# Altium project golgi_bot_raspberry.PrjPcb
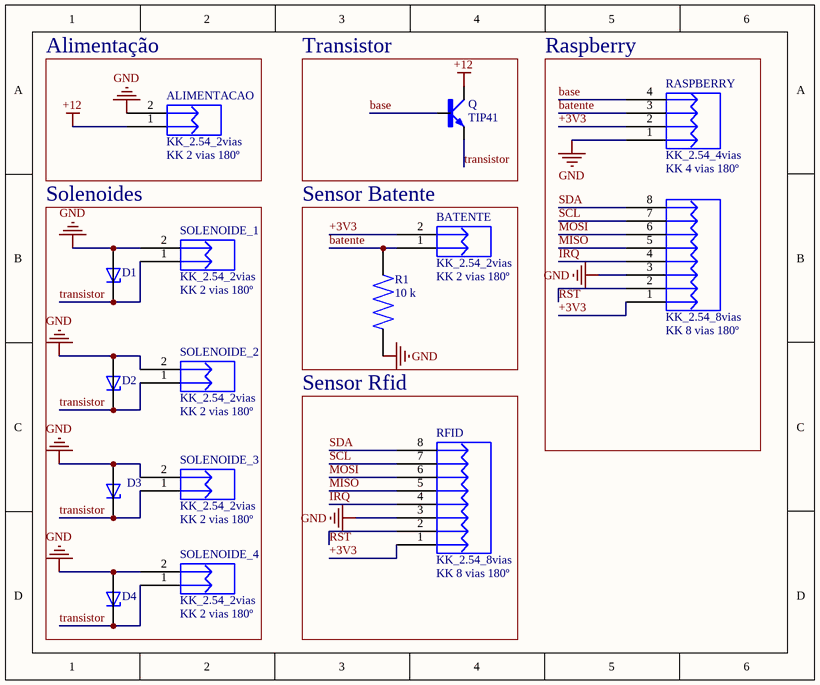
[diagram p0: golgi_bot_raspberry.SchDoc]
1 sheet, 15 parts. Net scope: global (net labels, ports and power ports of the same name join across sheets).
Board file: golgi_bot_raspberry.PcbDoc

## Sheet golgi_bot_raspberry.SchDoc
size 152 x 127 mm; SheetNumber: 1; SheetTotal: 1

### Parts
ALIMENTACAO  KK_2.54_2vias  Valor: KK 2 vias 180º  [KK_2VIAS_180º]
BATENTE  KK_2.54_2vias  Valor: KK 2 vias 180º  [KK_2VIAS_180º]
D1  (no value)  [SODFL3718X102N]
D2  (no value)  [SODFL3718X102N]
D3  (no value)  [SODFL3718X102N]
D4  (no value)  [SODFL3718X102N]
Q  TIP41  [TRANSISTOR-TO220AV-BCE]
R1  10 k  [RESC3115X65N]
RASPBERRY  KK_2.54_4vias  Valor: KK 4 vias 180º  [KK_4vias_180°]
RFID  KK_2.54_8vias  Valor: KK 8 vias 180º  [KK_8vias_180°]
SOLENOIDE_1  KK_2.54_2vias  Valor: KK 2 vias 180º  [KK_2VIAS_180º]
SOLENOIDE_2  KK_2.54_2vias  Valor: KK 2 vias 180º  [KK_2VIAS_180º]
SOLENOIDE_3  KK_2.54_2vias  Valor: KK 2 vias 180º  [KK_2VIAS_180º]
SOLENOIDE_4  KK_2.54_2vias  Valor: KK 2 vias 180º  [KK_2VIAS_180º]
  KK_2.54_8vias  Valor: KK 8 vias 180º  [KK_8vias_180°]

### Blocks framed on the sheet
Alimentação: ALIMENTACAO
Transistor: Q
Raspberry: RASPBERRY 
Solenoides: D1-D4 SOLENOIDE_1-SOLENOIDE_4
Sensor Batente: BATENTE R1
Sensor Rfid: RFID

### Nets
+12: ALIMENTACAO.1 Q.C
GND: ALIMENTACAO.2 D1.A D2.A D3.A D4.A R1.1 RASPBERRY.1 RFID.3 SOLENOIDE_1.2 SOLENOIDE_2.2 SOLENOIDE_3.2 SOLENOIDE_4.2 .3
+3V3: BATENTE.2 RASPBERRY.2 RFID.1 .1
base: Q.B RASPBERRY.4
batente: BATENTE.1 R1.2 RASPBERRY.3
IRQ: RFID.4 .4
MISO: RFID.5 .5
MOSI: RFID.6 .6
RST: RFID.2 .2
SCL: RFID.7 .7
SDA: RFID.8 .8
transistor: D1.C D2.C D3.C D4.C Q.E SOLENOIDE_1.1 SOLENOIDE_2.1 SOLENOIDE_3.1 SOLENOIDE_4.1

### Library data of the parts
ALIMENTACAO BATENTE SOLENOIDE_1-SOLENOIDE_4 = KK_2.54_2vias: Conector KK 2.54mm 2 vias; Descrição: Conector KK 3 vias com passo 2.54mm; Encapsulamento: PTH - 180º; Modelo: 2 vias - 180º; Marca: *; Observação: *
D1-D4 = SMF12A: 19.9V Clamp 10.1A Ipp Tvs Diode Surface Mount SOD-123F; MF: Littelfuse Inc.; Value: *; Package: SOD-123F Littelfuse; Purchase-URL: https://pricing.snapeda.com/search/part/SMF12A/?ref=eda; Check_prices: https://www.snapeda.com/parts/SMF12A/Littelfuse/view-part/?ref=eda; Price: None; MP: SMF12A; Availability: In Stock; SnapEDA_Link: https://www.snapeda.com/parts/SMF12A/Littelfuse/view-part/?ref=snap
Q = TIP41: Bipolar Transistors - BJT 6A 40V 65W NPN; MF: ON Semiconductor; Package: None; Value: *; MP: TIP41; SnapEDA_Link: https://www.snapeda.com/parts/TIP41/ON%20Semiconductor/view-part/4725228/?ref=snap; Availability: Unavailable; Price: None
R1 = CRGCQ1206F10K: Fixed Resistor CRGCQ 1206 10K 1%; MF: TE Connectivity; MP: CRGCQ1206F10K; Price: None; DigiKey-Purchase-URL: https://snapeda.com/shop?store=DigiKey&id=3187322; Package: 3115 TE Connectivity; Mouser-Purchase-URL: https://snapeda.com/shop?store=Mouser&id=3187322; Value: *; Availability: Unavailable; Arrow_Electronics-Purchase-URL: https://snapeda.com/shop?store=Arrow+Electronics&id=3187322; SnapEDA_Link: https://www.snapeda.com/parts/CRGCQ1206F10K/TE%20Connectivity/view-part/3187322/?ref=snap
RASPBERRY = KK_2.54_4vias: Conector KK 2.54mm 4 vias; Descrição: Conector KK 3 vias com passo 2.54mm; Encapsulamento: PTH - 180º; Modelo: 3 vias - 180º; Marca: *; Observação: *
RFID  = KK_2.54_8vias: Conector KK 2.54mm 8 vias; Descrição: Conector KK 3 vias com passo 2.54mm; Encapsulamento: PTH - 180º; Modelo: 3 vias - 180º